# EAGLE design smart_headphones_rev_Nov2016 (EAGLE 7.7.0)
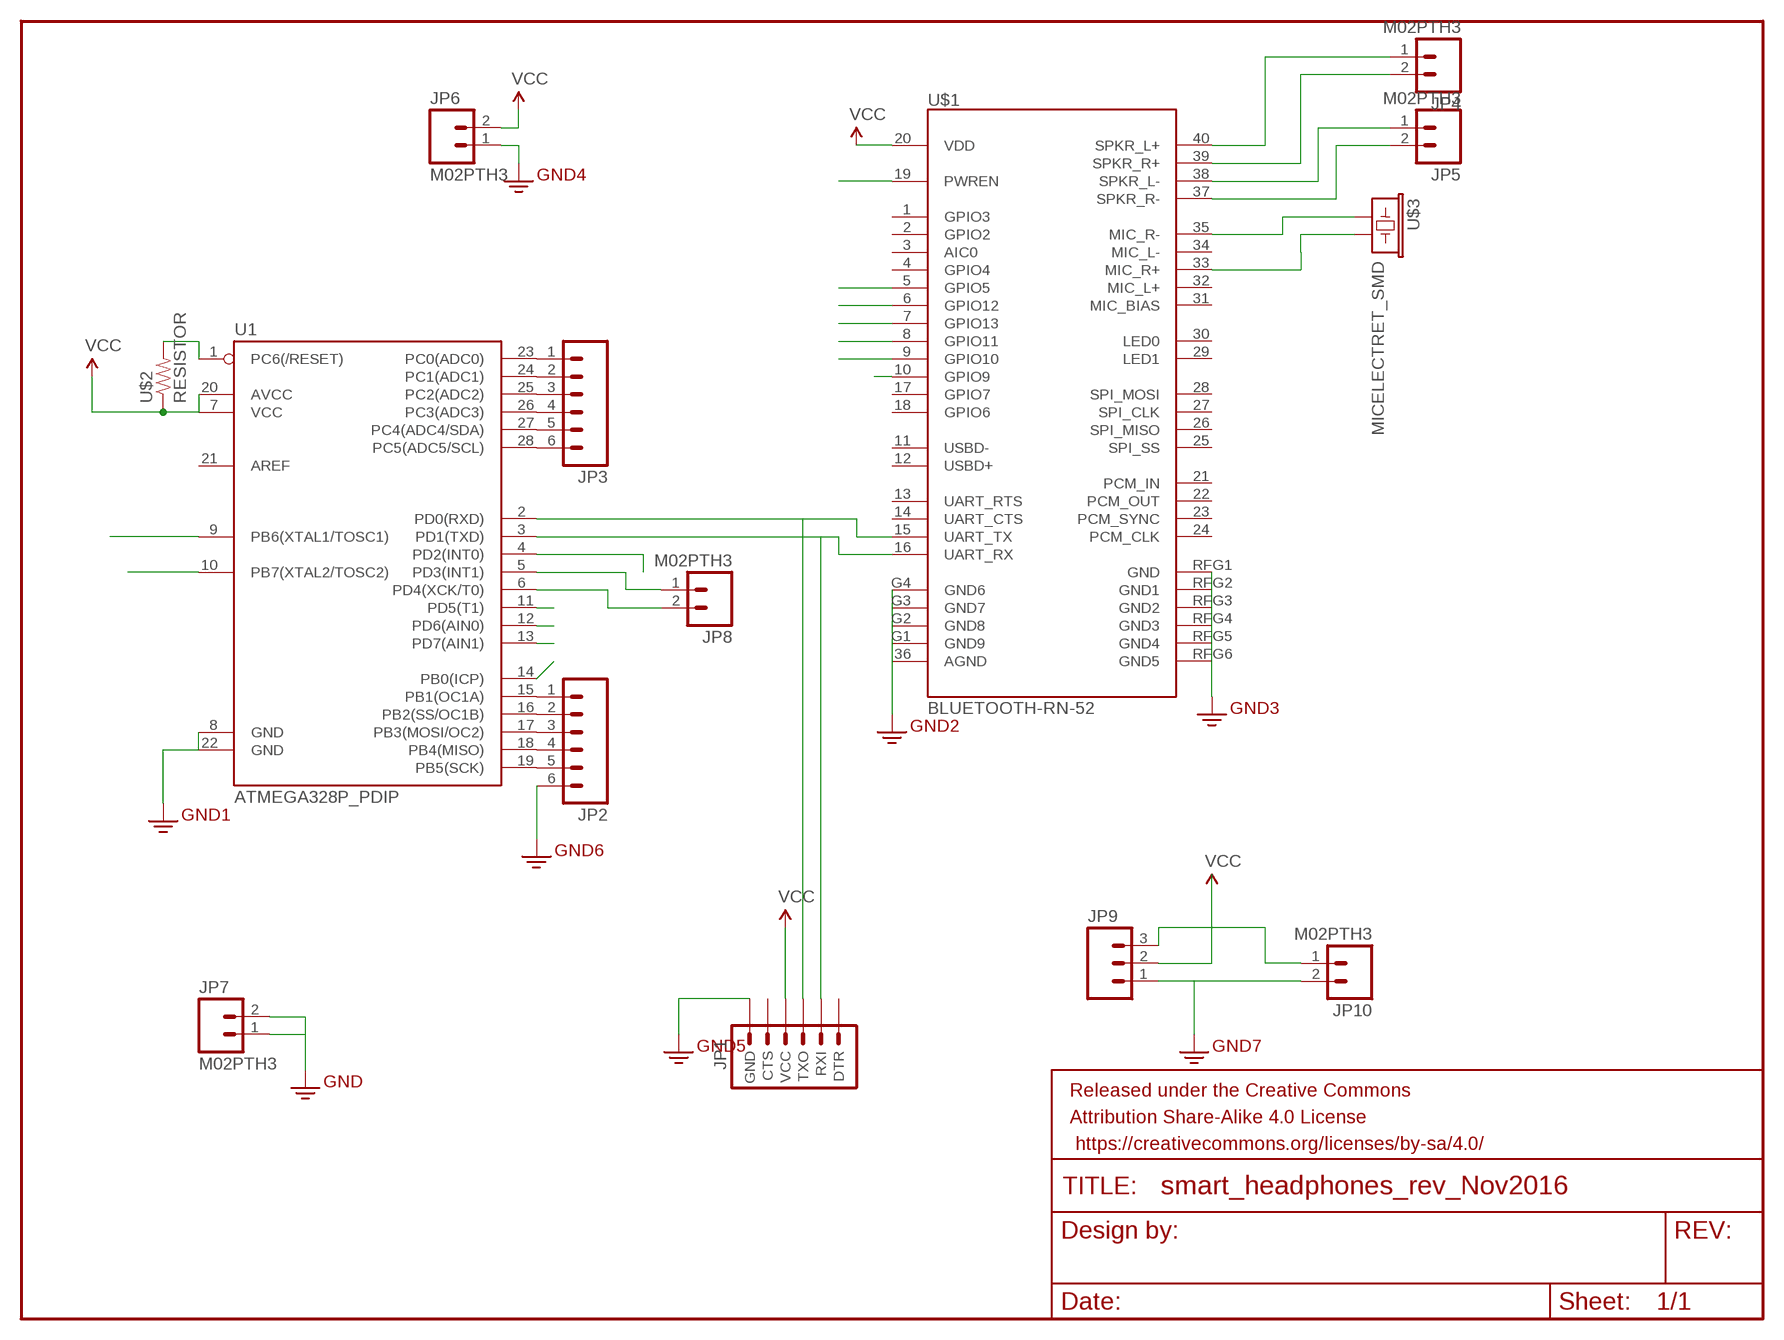
[diagram p0: schematic, sheet 1]

## Parts
JP1  FTDI_SERIAL_PROGRAMMER_PORTLONGPADS  [1X06_LONGPADS]
JP2  M06LONGPADS  [1X06_LONGPADS]
JP3  M06LONGPADS  [1X06_LONGPADS]
JP4  M02PTH3  [1X02_LONGPADS]
JP5  M02PTH3  [1X02_LONGPADS]
JP6  M02PTH3  [1X02_LONGPADS]
JP7  M02PTH3  [1X02_LONGPADS]
JP8  M02PTH3  [1X02_LONGPADS]
JP9  M03LONGPADS  [1X03_LONGPADS]
JP10  M02PTH3  [1X02_LONGPADS]
U1  ATMEGA328P_PDIP  [DIP28]
U$1  BLUETOOTH-RN-52  [RN-52]
U$2  RESISTOR  [0805]
U$3  MICELECTRET_SMD  [MIC_ELECTRET_SMD]

## Nets
GND: JP1.6(GND) JP2.6 JP6.1 JP7.1 JP7.2 JP9.1 JP10.2 U1.8(GND) U1.22(GND) U$1.36(AGND) U$1.G1(GND9) U$1.G2(GND8) U$1.G3(GND7) U$1.G4(GND6) U$1.RFG1(GND) U$1.RFG2(GND1) U$1.RFG3(GND2) U$1.RFG4(GND3) U$1.RFG5(GND4) U$1.RFG6(GND5)
N$1: JP2.1 U1.15(PB1(OC1A))
N$2: JP2.2 U1.16(PB2(SS/OC1B))
N$3: JP5.2 U$1.37(SPKR_R-)
N$4: U1.1(PC6(/RESET)) U$2.2
N$5: JP1.3(TXO) U1.2(PD0(RXD)) U$1.15(UART_TX)
N$6: JP2.3 U1.17(PB3(MOSI/OC2))
N$7: JP4.1 U$1.40(SPKR_L+)
N$8: JP4.2 U$1.39(SPKR_R+)
N$9: JP2.4 U1.18(PB4(MISO))
N$10: JP1.2(RXI) U1.3(PD1(TXD)) U$1.16(UART_RX)
N$11: JP2.5 U1.19(PB5(SCK))
N$12: JP5.1 U$1.38(SPKR_L-)
N$13: U$1.35(MIC_R-) U$3.1
N$14: U$1.33(MIC_R+) U$3.2
N$18: JP8.1 U1.5(PD3(INT1))
N$19: JP8.2 U1.6(PD4(XCK/T0))
N$20: JP9.3 JP10.1
N$32: JP3.1 U1.23(PC0(ADC0))
N$33: JP3.2 U1.24(PC1(ADC1))
N$34: JP3.3 U1.25(PC2(ADC2))
N$35: JP3.4 U1.26(PC3(ADC3))
N$36: JP3.5 U1.27(PC4(ADC4/SDA))
N$37: JP3.6 U1.28(PC5(ADC5/SCL))
PB0: U1.14(PB0(ICP)) U$1.5(GPIO5)
PB6: U1.9(PB6(XTAL1/TOSC1)) U$1.10(GPIO9)
PB7: U1.10(PB7(XTAL2/TOSC2)) U$1.9(GPIO10)
PD5: U1.11(PD5(T1)) U$1.8(GPIO11)
PD6: U1.12(PD6(AIN0)) U$1.7(GPIO13)
PD7: U1.13(PD7(AIN1)) U$1.6(GPIO12)
PWREN: U1.4(PD2(INT0)) U$1.19(PWREN)
VCC: JP1.4(VCC) JP6.2 JP9.2 U1.7(VCC) U1.20(AVCC) U$1.20(VDD) U$2.1
Unconnected: JP1.1(DTR) JP1.5(CTS) U1.21(AREF) U$1.1(GPIO3) U$1.2(GPIO2) U$1.3(AIC0) U$1.4(GPIO4) U$1.11(USBD-) U$1.12(USBD+) U$1.13(UART_RTS) U$1.14(UART_CTS) U$1.17(GPIO7) U$1.18(GPIO6) U$1.21(PCM_IN) U$1.22(PCM_OUT) U$1.23(PCM_SYNC) U$1.24(PCM_CLK) U$1.25(SPI_SS) U$1.26(SPI_MISO) U$1.27(SPI_CLK) U$1.28(SPI_MOSI) U$1.29(LED1) U$1.30(LED0) U$1.31(MIC_BIAS) U$1.32(MIC_L+) U$1.34(MIC_L-)

## Library data of the parts
JP1 = Finn-lbr-rev1:FTDI_SERIAL_PROGRAMMER_PORT: FTDI connector footprints
JP2 JP3 = Finn-lbr-rev1:M06: Header 6 Standard 6-pin 0.1" header. Use with straight break away headers (SKU : PRT-00116), right angle break away headers (PRT-00553), swiss pins (PRT-00743), machine pins (PRT-00117), and female headers (PRT-00115). Molex polarized connector foot print use with SKU : PRT-08094 with associated crimp pins and housings.
JP4-JP8 JP10 = Finn-lbr-rev1:M02: Standard 2-pin 0.1" header. Use with - straight break away headers ( PRT-00116) - right angle break away headers (PRT-00553) - swiss pins (PRT-00743) - machine pins (PRT-00117) - female headers (PRT-00115) Molex polarized connector foot print use with: PRT-08233 with associated crimp pins and housings. 2.54_SCREWTERM for use with PRT-10571. 3.5mm Screw Terminal footprints for PRT-08084 5mm Screw Terminal footprints for use with PRT-08432
JP9 = Finn-lbr-rev1:M03: Header 3 Standard 3-pin 0.1" header. Use with straight break away headers (SKU : PRT-00116), right angle break away headers (PRT-00553), swiss pins (PRT-00743), machine pins (PRT-00117), and female headers (PRT-00115). Molex polarized connector foot print use with SKU : PRT-08232 with associated crimp pins and housings.
U1 = Finn-lbr-rev1:ATMEGA328P_PDIP: uC used in the Arduino 32kb flash, 1k EEPROM, 2k SRAM This is the through-hole version of this chip.
U$1 = Finn-lbr-rev1:BLUETOOTH-RN-52
U$2 = Finn-lbr-rev1:RESISTOR: It's just a resistor
U$3 = Finn-lbr-rev1:MIC: Omni-directional electret microphone. 9.7mm standard diameter.

## Board
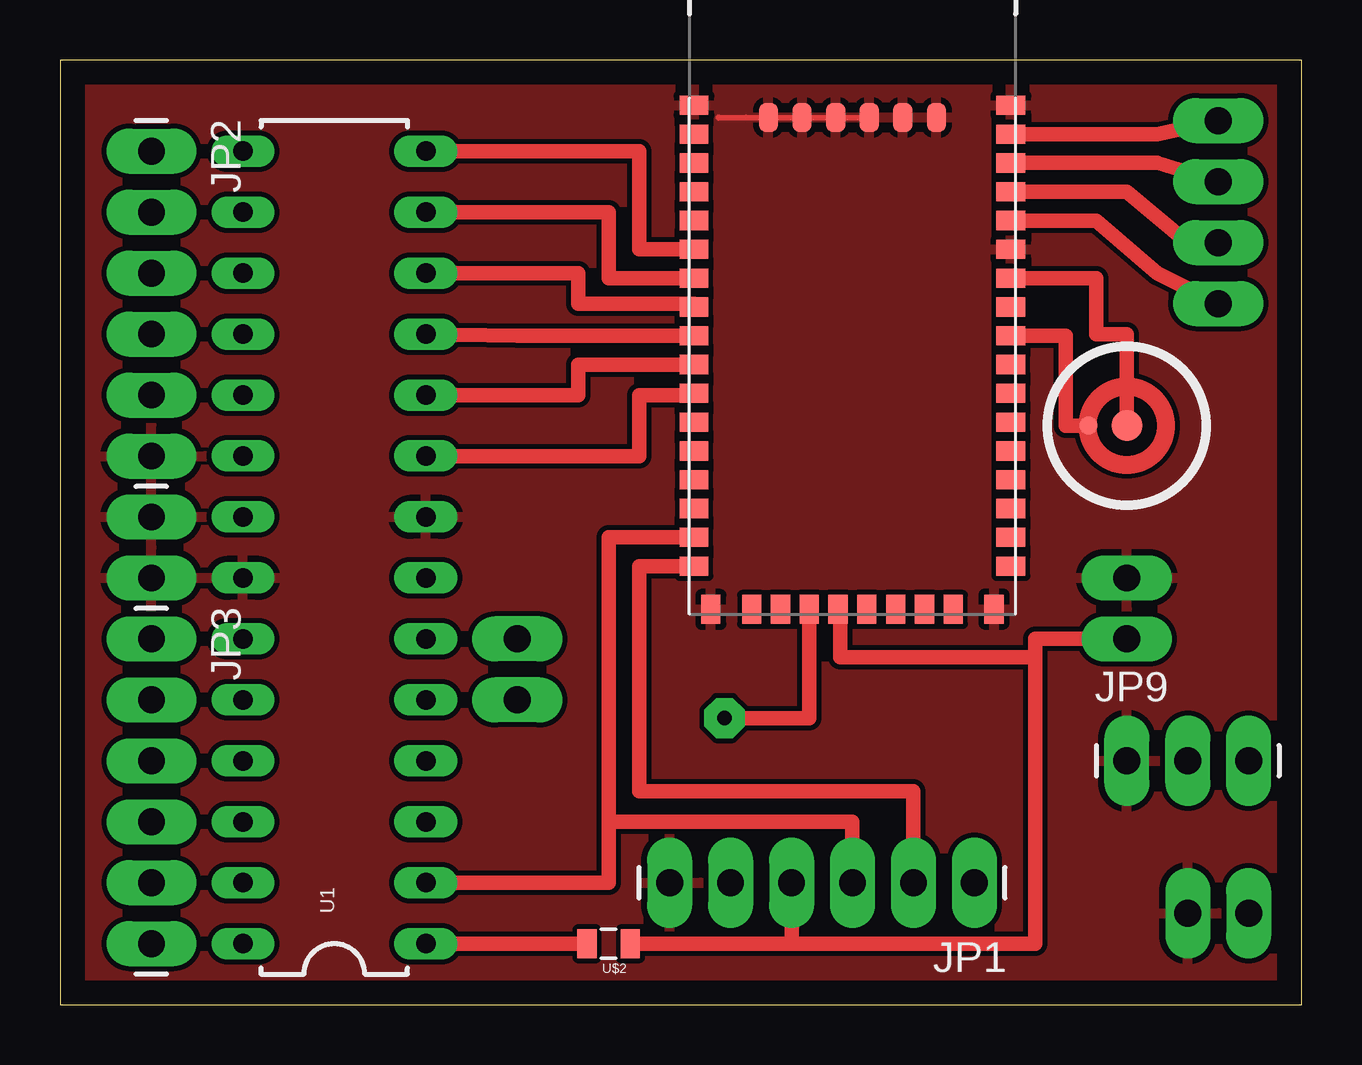
[diagram p1: board, top side]
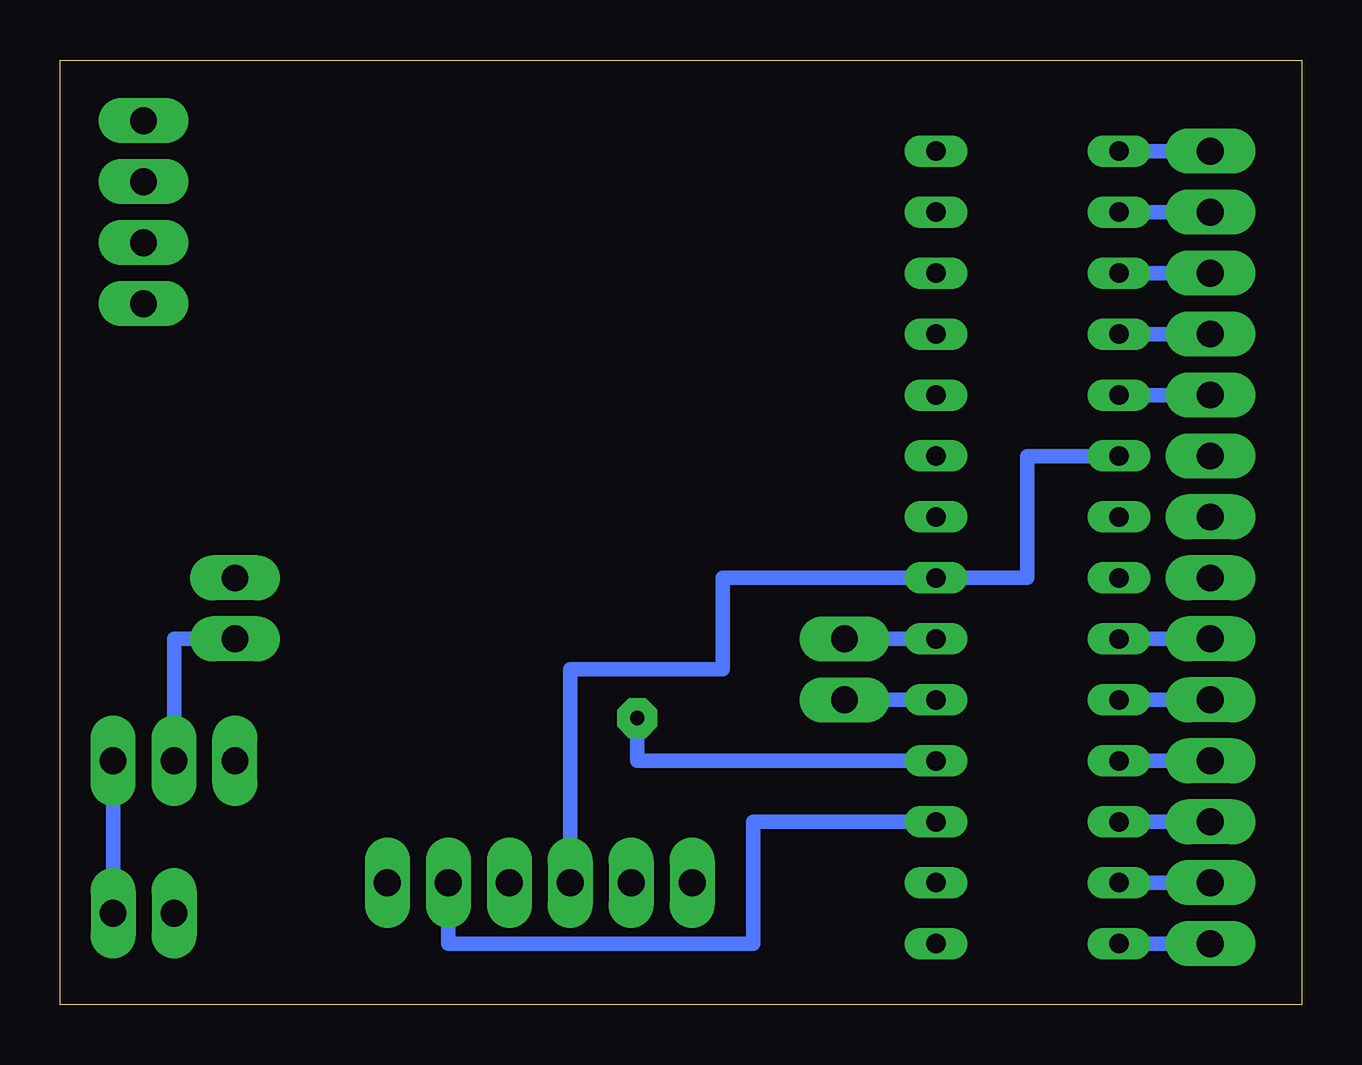
[diagram p2: board, bottom side, seen from below]

Size 51.74 x 39.36 mm. Coordinates in mm from the lower left corner, seen from the top.
Outline: 0,0 51.74,0 51.74,39.36 0,39.36 0,0
Copper layers (1*16): Top 0.035mm / dielectric 1.5mm / Bottom 0.035mm
Design rules "default": minimum track width 10mil, minimum drill 24mil, track to track 8mil, track to pad 8mil, pad to pad 8mil, via to via 8mil, smd to smd 8mil, copper to edge 40mil, drill to drill 8mil, minimum pad ring 10mil, minimum via ring 8mil, stop-mask expansion 4mil, vias tented up to drill 0mil, thermal gap 10mil

### Footprints (pad centres in the part's own frame; a part is rotated, then mirrored left to right if it is on the bottom)
1X06_LONGPADS = drill 1.118 pad 1.88 long: 1 0,0; 2 2.54,0; 3 5.08,0; 4 7.62,0; 5 10.16,0; 6 12.7,0
1X02_LONGPADS = drill 1.118 pad 1.88 long: 1 0,0; 2 2.54,0
1X03_LONGPADS = drill 1.118 pad 1.88 long: 1 0,0; 2 2.54,0; 3 5.08,0
DIP28 = drill 0.813 long: 1 -16.51,-3.81; 2 -13.97,-3.81; 3 -11.43,-3.81; 4 -8.89,-3.81; 5 -6.35,-3.81; 6 -3.81,-3.81; 7 -1.27,-3.81; 8 1.27,-3.81; 9 3.81,-3.81; 10 6.35,-3.81; 11 8.89,-3.81; 12 11.43,-3.81; 13 13.97,-3.81; 14 16.51,-3.81; 15 16.51,3.81; 16 13.97,3.81; 17 11.43,3.81; 18 8.89,3.81; 19 6.35,3.81; 20 3.81,3.81; 21 1.27,3.81; 22 -1.27,3.81; 23 -3.81,3.81; 24 -6.35,3.81; 25 -8.89,3.81; 26 -11.43,3.81; 27 -13.97,3.81; 28 -16.51,3.81
RN-52 = smd 1.2 x 0.8: 1 -6.6,8.33; 2 -6.6,7.13; 3 -6.6,5.93; 4 -6.6,4.73; 5 -6.6,3.53; 6 -6.6,2.33; 7 -6.6,1.13; 8 -6.6,-0.07; 9 -6.6,-1.27; 10 -6.6,-2.47; 11 -6.6,-3.67; 12 -6.6,-4.87; 13 -6.6,-6.07; 14 -6.6,-7.27; 15 -6.6,-8.47; 16 -6.6,-9.67; 25 6.6,-9.67; 26 6.6,-8.47; 27 6.6,-7.27; 28 6.6,-6.07; 29 6.6,-4.87; 30 6.6,-3.67; 31 6.6,-2.47; 32 6.6,-1.27; 33 6.6,-0.07; 34 6.6,1.13; 35 6.6,2.33; 36 6.6,3.53; 37 6.6,4.73; 38 6.6,5.93; 39 6.6,7.13; 40 6.6,8.33; G1 -6.6,9.53; G4 6.6,9.53 | smd 0.8 x 1.2: 17 -4.2,-11.47; 18 -3,-11.47; 19 -1.8,-11.47; 20 -0.6,-11.47; 21 0.6,-11.47; 22 1.8,-11.47; 23 3,-11.47; 24 4.2,-11.47; G2 -5.9,-11.47; G3 5.9,-11.46; RFG1 -3.5,9.03; RFG2 -2.1,9.03; RFG3 -0.7,9.03; RFG4 0.7,9.03; RFG5 2.1,9.03; RFG6 3.5,9.03
0805 = smd 0.8 x 1.2: 1 -0.9,0; 2 0.9,0
MIC_ELECTRET_SMD = smd 1.3 x 1.3: 1 0,0 | smd 0.75 x 0.75: 2 0,1.6

### Placement (x,y rotation side)
JP1  38.1,5.08 180 top
JP2  3.81,35.56 270 top
JP3  3.81,15.24 270 top
JP4  48.26,36.83 270 top
JP5  48.26,31.75 270 top
JP6  44.45,17.78 270 top
JP7  3.81,20.32 270 top
JP8  19.05,12.7 90 top
JP9  44.45,10.16 0 top
JP10  49.53,3.81 180 top
U1  11.43,19.05 90 top
U$1  33.02,27.94 0 top
U$2  22.86,2.54 180 top
U$3  44.45,24.13 90 top

### Tracks (layer width: path | path; a pad name or v marks a point on that pad's centre or on a via)
GND
  Top 0.254: 27.43,36.96 U$1.RFG3 | 28.57,36.96 U$1.RFG4
  pour Top: -1.27,39.37 52.07,39.37 52.07,0 -1.27,0
N$1
  Bottom 0.61: JP2.1 U1.15
N$2
  Bottom 0.61: JP2.2 U1.16
N$3
  Top 0.61: U$1.37 43.18,32.67 45.72,30.48 JP5.2
N$4
  Top 0.61: U1.1 U$2.2
N$5
  Top 0.61: U$1.15 22.86,19.47 22.86,7.62 | 22.86,7.62 33.02,7.62 JP1.3 | U1.2 22.86,5.08 22.86,7.62
N$6
  Bottom 0.61: JP2.3 U1.17
N$7
  Top 0.61: U$1.40 45.72,36.27 JP4.1
N$8
  Top 0.61: U$1.39 45.72,35.07 JP4.2
N$9
  Bottom 0.61: JP2.4 U1.18
N$10
  Top 0.61: U$1.16 24.13,18.27 24.13,8.89 35.56,8.89 JP1.2
  Bottom 0.61: U1.3 22.86,7.62 22.86,2.54 35.56,2.54 JP1.2
N$11
  Bottom 0.61: JP2.5 U1.19
N$12
  Top 0.61: U$1.38 44.45,33.87 46.99,31.75 JP5.1
N$13
  Top 0.61: U$1.35 43.18,30.27 43.18,27.94 44.45,27.94 U$3.1
N$14
  Top 0.61: U$3.2 41.91,24.13 41.91,27.87 U$1.33
N$18
  Bottom 0.61: U1.5 JP8.1
N$19
  Bottom 0.61: U1.6 JP8.2
N$20
  Bottom 0.61: JP10.1 JP9.3
N$32
  Bottom 0.61: JP3.1 U1.23
N$33
  Bottom 0.61: JP3.2 U1.24
N$34
  Bottom 0.61: JP3.3 U1.25
N$35
  Bottom 0.61: JP3.4 U1.26
N$36
  Bottom 0.61: JP3.5 U1.27
N$37
  Bottom 0.61: JP3.6 U1.28
PB0
  Top 0.61: U$1.5 24.13,31.47 24.13,35.56 U1.14
PB6
  Top 0.61: U1.9 24.13,22.86 24.13,25.4 26.42,25.4 U$1.10
PB7
  Top 0.61: U$1.9 21.59,26.67 21.59,25.4 U1.10
PD5
  Top 0.61: U$1.8 19.05,27.87 U1.11
PD6
  Top 0.61: U1.12 21.59,30.48 21.59,29.21 26.42,29.21 U$1.7
PD7
  Top 0.61: U$1.6 22.86,30.27 22.86,33.02 U1.13
PWREN  (via drill 0.6 pad 1.68)
  Top 0.61: v27.69,11.94 31.22,11.94 U$1.19
  Bottom 0.61: U1.4 27.69,10.16 v27.69,11.94
VCC
  Top 0.61: U$2.1 30.48,2.54 | 30.48,2.54 JP1.4 | U$1.20 32.51,16.47 32.51,14.48 40.64,14.48 | 40.64,14.48 40.64,15.24 JP6.2 | 40.64,14.48 40.64,2.54 30.48,2.54
  Bottom 0.61: JP1.4 30.48,13.97 24.13,13.97 24.13,17.78 U1.7 11.43,17.78 11.43,22.86 U1.20 | JP9.2 46.99,15.24 JP6.2

### Text on the board
Document: FinnAudio | Smart Headphones Board | Rev. November 6, 2016 | Left Audio Out + | D9 (PWM) PB1 | Right Audio Out + | D10 (PWM) PB2 | Left Audio Out - | D11 (PWM) PB3 | Right Audio Out - | D12 () PB4 | D13 () PB5 | GND | GND | GND | GND | A0 () PC0 | 3.3V | A1 () PC1 | A2 () PC2 | Vreg Module | A3 () PC3 | A4 () PC4 | A5 () PC5 | Vsupply | D2-4 () PD2-4 | GND | (consider routing / through switch) | Serial Connection | GND | 3.3V | TXO | RXI